# EAGLE schematic 3-3V_regulator (EAGLE 7.6.0)
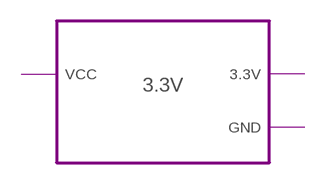
[diagram p0: schematic, sheet 1]

## Module instances
3.3V = REGULATOR

## Library data of the parts

## Module REGULATOR
Ports: VCC(io) 3.3V(io) GND(io)
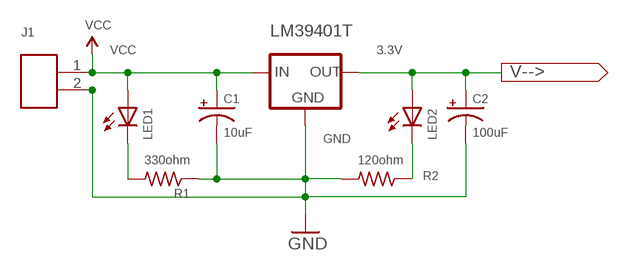
[diagram p1: schematic, module REGULATOR, sheet 1]

### Parts
C1  10uF  CAP_POLPTH2  [CPOL-RADIAL-10UF-25V]
C2  100uF  CAP_POLPTH1  [CPOL-RADIAL-100UF-25V]
J1  SCREW-TERMINAL_2_0.100  [CONN_BLOCK_2]
LED1  TLLR4400  [LED3MM]
LED2  TLLY4400  [LED3MM]
LM39401T  V_REG_LD1117VXX  [78XXL]
R1  330ohm  R-US_0207/2V  [0207/2V]
R2  120ohm  R-US_0207/2V  [0207/2V]

### Nets
3.3V [3.3V]: C2.1(+) LED2.A LM39401T.GND(OUT)
GND [GND]: C1.2(-) C2.2(-) J1.2 LM39401T.IN(GND) R1.1 R2.2
N$1: LED2.K(C) R2.1
N$3: LED1.K(C) R1.2
VCC [VCC]: C1.1(+) J1.1 LED1.A LM39401T.OUT(IN)

### Library data of the parts
C1 C2 = SparkFun-Capacitors:CAP_POL: Capacitor Polarized These are standard SMD and PTH capacitors. Normally 10uF, 47uF, and 100uF in electrolytic and tantalum varieties. Always verify the external diameter of the through hole cap, it varies with capacity, voltage, and manufacturer. The EIA devices should be standard.
J1 = headers:SCREW-TERMINAL_2_0.100: 2x 0.100 in screw terminal block; DIGIKEY: 277-1273-ND; MOUSER: 651-1725656; NEWARK: 71C4107
LED1 = led:TLLR4400: Low Current (2mA) LED 3 mm Tinted Diffused Package color RED Source: Data sheet <http://www.farnell.com/datasheets/391100.pdf>; MF: VISHAY SEMICONDUCTOR; OC_FARNELL: 1612437
LED2 = led:TLLY4400: Low Current (2mA) LED 3 mm Tinted Diffused Package color YELLOW Source: Data sheet <http://www.farnell.com/datasheets/391098.pdf>; MF: VISHAY SEMICONDUCTOR; OC_FARNELL: 1612439
LM39401T = SparkFun-PowerIC:V_REG_LD1117VXX: LD1117VXX voltage regulator. We carry the 3.3V version (COM-00526) in TO-220 package.
R1 R2 = resistor:R-US_: RESISTOR, American symbol